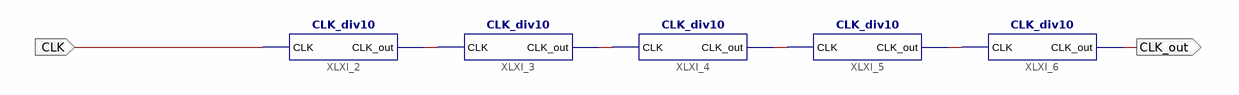
[diagram p0: schematic sheet 1]
// Xilinx ISE schematic CLK_divmain.sch (spartan6) as structural Verilog: 5 symbols, 2 ports
module CLK_divmain (
  input  CLK,
  output CLK_out
);

  wire XLXN_2, XLXN_3, XLXN_4, XLXN_5;

  CLK_div10 XLXI_2 (.CLK(CLK), .CLK_out(XLXN_2));
  CLK_div10 XLXI_3 (.CLK(XLXN_2), .CLK_out(XLXN_3));
  CLK_div10 XLXI_4 (.CLK(XLXN_3), .CLK_out(XLXN_4));
  CLK_div10 XLXI_5 (.CLK(XLXN_4), .CLK_out(XLXN_5));
  CLK_div10 XLXI_6 (.CLK(XLXN_5), .CLK_out(CLK_out));
endmodule
